# EAGLE design SteeringV2 (EAGLE 9.6.2)
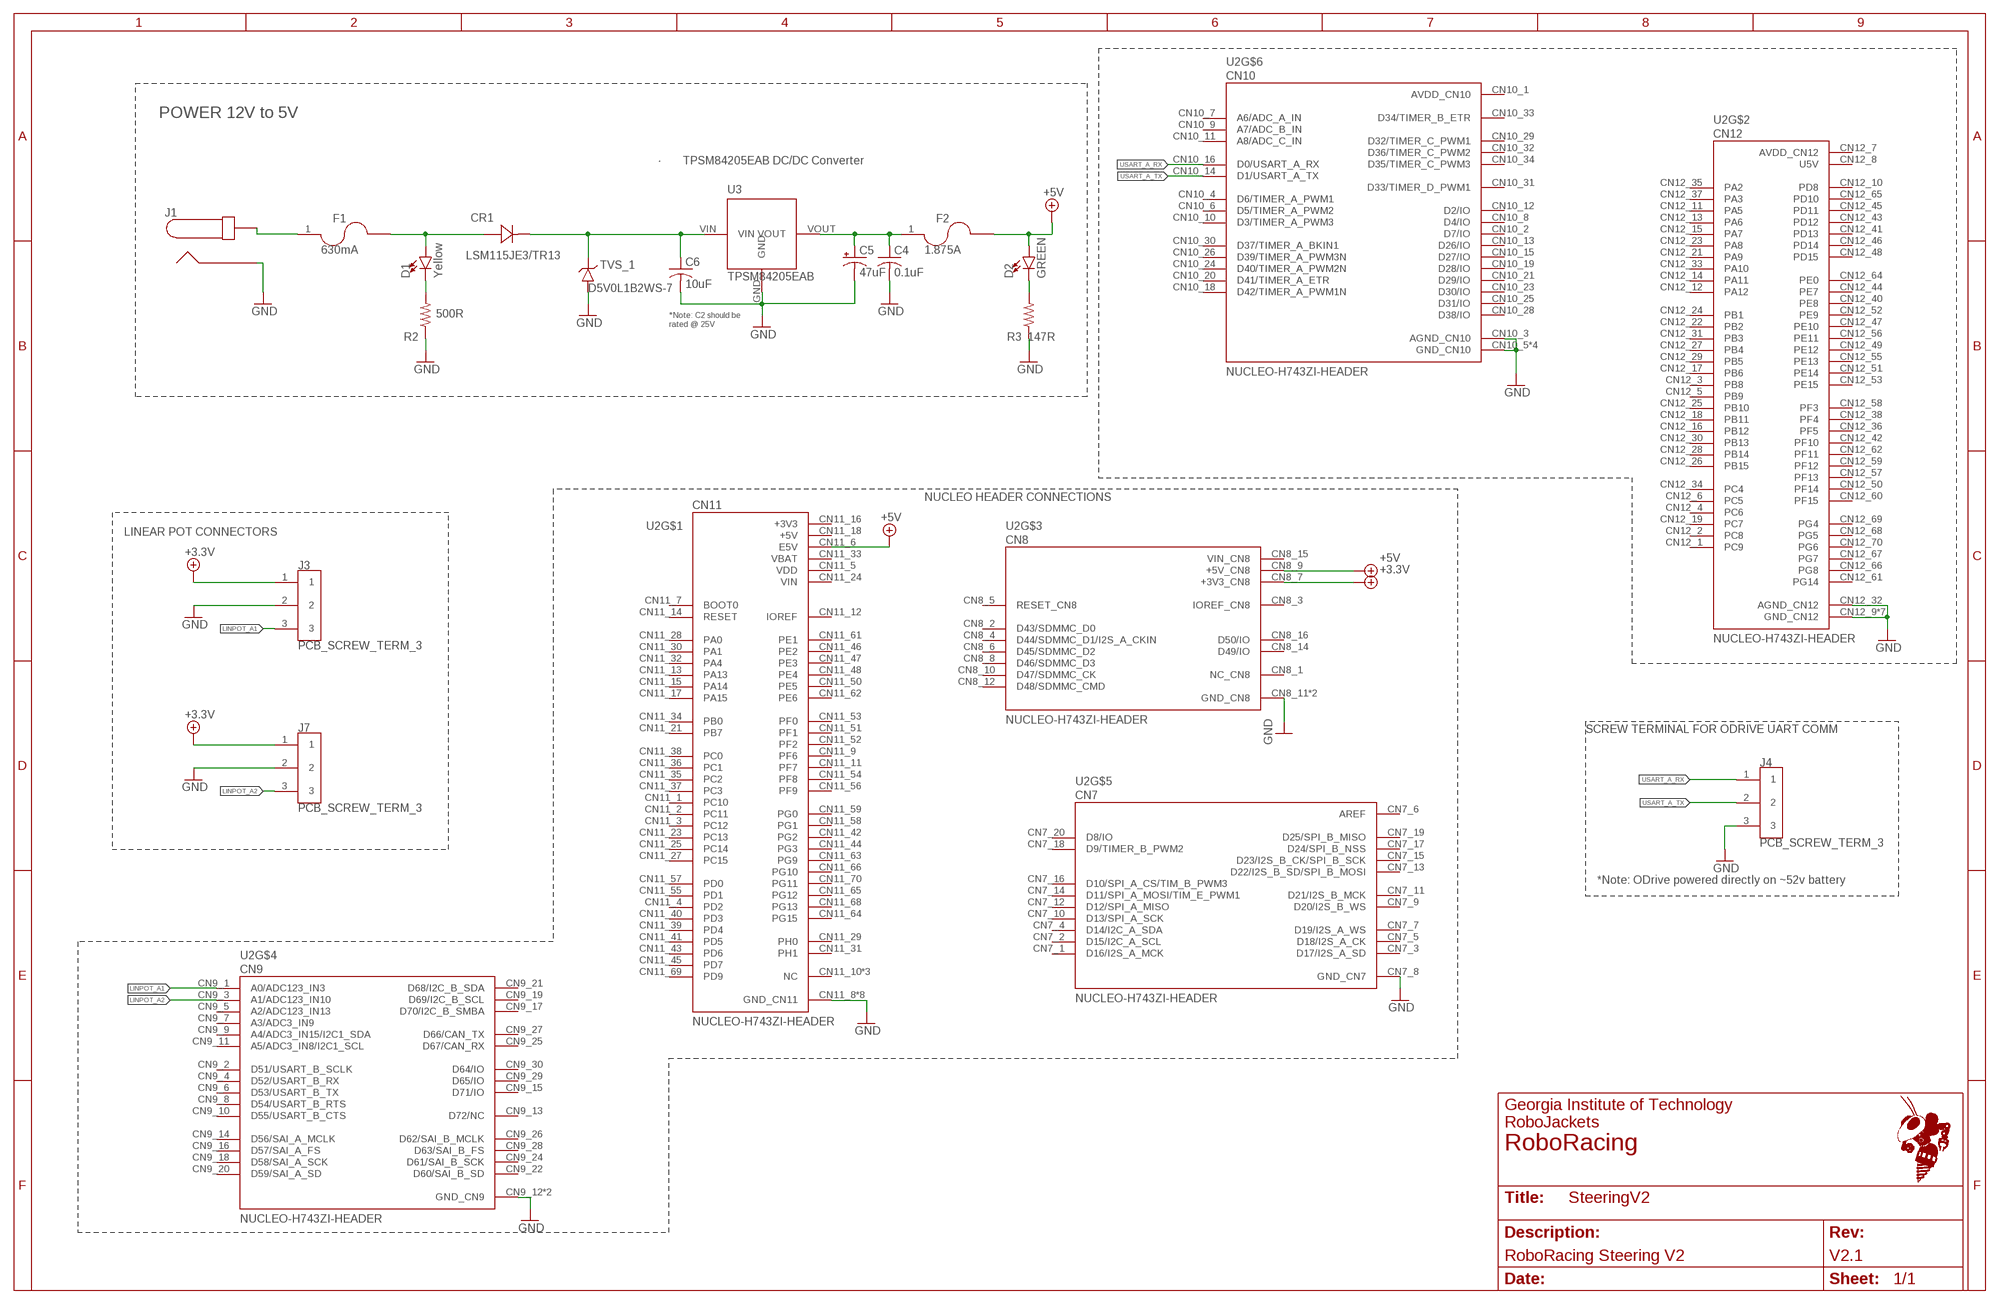
[diagram p0: schematic, sheet 1]
FRAME1 (FRAME_11_17): REVISION: V2.1; SCH_DESC: RoboRacing Steering V2; TEAM: RoboRacing

## Parts
C4  0.1uF  C-USC0805  [C0805]
C5  47uF  47UF-POLAR-EIA3528-10V-10%  [EIA3528]
C6  10uF  C-USC0805  [C0805]
CR1  LSM115JE3/TR13  [DO-214BA_MCH]
D1  Yellow  LED-YELLOW0603  [LED-0603]
D2  GREEN  LED-GREEN1206  [LED-1206]
F1  630mA  SMD_FUSE0603  [F0603]
F2  1.875A  SMD_FUSE0603  [F0603]
J1  PJ-037A  [PJ-037A]
J3  PCB_SCREW_TERM_3  [SCREW_TERMINAL_PCB_CONN_3_POLE]
J4  PCB_SCREW_TERM_3  [SCREW_TERMINAL_PCB_CONN_3_POLE]
J7  PCB_SCREW_TERM_3  [SCREW_TERMINAL_PCB_CONN_3_POLE]
R2  500R  R-US_R0603  [R0603]
R3  147R  R-US_R0603  [R0603]
TVS_1  D5V0L1B2WS-7  [SOD-323]
U2  NUCLEO-H743ZI-HEADER  [MODULE_NUCLEO-H743ZI]
U3  TPSM84205EAB  [TPSM84205EAB]

## Nets
5V_MAIN: C4.1 C5.A(+) F2.1 U3.VOUT
+3.3V: J3.1 J7.1 U2.CN8_7(+3V3_CN8)
+5V: D2.A F2.2 U2.CN8_9(+5V_CN8) U2.CN11_6(E5V)
GND: C4.2 C5.C(-) C6.2 J1.P$1 J3.2 J4.3 J7.2 R2.1 R3.1 TVS_1.A U2.CN7_8(GND_CN7) U2.CN8_11(GND_CN8) U2.CN8_13(GND_CN8) U2.CN9_12(GND_CN9) U2.CN9_23(GND_CN9) U2.CN10_3(AGND_CN10) U2.CN10_5(GND_CN10) U2.CN10_17(GND_CN10) U2.CN10_22(GND_CN10) U2.CN10_27(GND_CN10) U2.CN11_8(GND_CN11) U2.CN11_19(GND_CN11) U2.CN11_20(GND_CN11) U2.CN11_22(GND_CN11) U2.CN11_49(GND_CN11) U2.CN11_60(GND_CN11) U2.CN11_71(GND_CN11) U2.CN11_72(GND_CN11) U2.CN12_9(GND_CN12) U2.CN12_20(GND_CN12) U2.CN12_32(AGND_CN12) U2.CN12_39(GND_CN12) U2.CN12_54(GND_CN12) U2.CN12_63(GND_CN12) U2.CN12_71(GND_CN12) U2.CN12_72(GND_CN12) U3.GND
LINPOT_A1: J3.3 U2.CN9_1(A0/ADC123_IN3)
LINPOT_A2: J7.3 U2.CN9_3(A1/ADC123_IN10)
N$1: CR1.2 D1.A F1.2
N$3: C6.1 CR1.1 TVS_1.C U3.VIN
N$4: F1.1 J1.P$2
N$5: D1.C R2.2
N$6: D2.C R3.2
USART_A_RX: J4.1 U2.CN10_16(D0/USART_A_RX)
USART_A_TX: J4.2 U2.CN10_14(D1/USART_A_TX)
Unconnected: U2.CN7_1(D16/I2S_A_MCK) U2.CN7_2(D15/I2C_A_SCL) U2.CN7_3(D17/I2S_A_SD) U2.CN7_4(D14/I2C_A_SDA) U2.CN7_5(D18/I2S_A_CK) U2.CN7_7(D19/I2S_A_WS) U2.CN7_9(D20/I2S_B_WS) U2.CN7_10(D13/SPI_A_SCK) U2.CN7_11(D21/I2S_B_MCK) U2.CN7_12(D12/SPI_A_MISO) U2.CN7_13(D22/I2S_B_SD/SPI_B_MOSI) U2.CN7_14(D11/SPI_A_MOSI/TIM_E_PWM1) U2.CN7_15(D23/I2S_B_CK/SPI_B_SCK) U2.CN7_16(D10/SPI_A_CS/TIM_B_PWM3) U2.CN7_17(D24/SPI_B_NSS) U2.CN7_18(D9/TIMER_B_PWM2) U2.CN7_19(D25/SPI_B_MISO) U2.CN7_20(D8/IO) U2.CN8_1(NC_CN8) U2.CN8_2(D43/SDMMC_D0) U2.CN8_3(IOREF_CN8) U2.CN8_4(D44/SDMMC_D1/I2S_A_CKIN) U2.CN8_5(RESET_CN8) U2.CN8_6(D45/SDMMC_D2) U2.CN8_8(D46/SDMMC_D3) U2.CN8_10(D47/SDMMC_CK) U2.CN8_12(D48/SDMMC_CMD) U2.CN8_14(D49/IO) U2.CN8_16(D50/IO) U2.CN9_2(D51/USART_B_SCLK) U2.CN9_4(D52/USART_B_RX) U2.CN9_5(A2/ADC123_IN13) U2.CN9_6(D53/USART_B_TX) U2.CN9_7(A3/ADC3_IN9) U2.CN9_8(D54/USART_B_RTS) U2.CN9_9(A4/ADC3_IN15/I2C1_SDA) U2.CN9_10(D55/USART_B_CTS) U2.CN9_11(A5/ADC3_IN8/I2C1_SCL) U2.CN9_13(D72/NC) U2.CN9_14(D56/SAI_A_MCLK) U2.CN9_15(D71/IO) U2.CN9_16(D57/SAI_A_FS) U2.CN9_17(D70/I2C_B_SMBA) U2.CN9_18(D58/SAI_A_SCK) U2.CN9_19(D69/I2C_B_SCL) U2.CN9_20(D59/SAI_A_SD) U2.CN9_21(D68/I2C_B_SDA) U2.CN9_22(D60/SAI_B_SD) U2.CN9_24(D61/SAI_B_SCK) U2.CN9_25(D67/CAN_RX) U2.CN9_26(D62/SAI_B_MCLK) U2.CN9_27(D66/CAN_TX) U2.CN9_28(D63/SAI_B_FS) U2.CN9_29(D65/IO) U2.CN9_30(D64/IO) U2.CN10_2(D7/IO) U2.CN10_4(D6/TIMER_A_PWM1) U2.CN10_6(D5/TIMER_A_PWM2) U2.CN10_7(A6/ADC_A_IN) U2.CN10_8(D4/IO) U2.CN10_9(A7/ADC_B_IN) U2.CN10_10(D3/TIMER_A_PWM3) U2.CN10_11(A8/ADC_C_IN) U2.CN10_12(D2/IO) U2.CN10_13(D26/IO) U2.CN10_15(D27/IO) U2.CN10_18(D42/TIMER_A_PWM1N) U2.CN10_19(D28/IO) U2.CN10_20(D41/TIMER_A_ETR) U2.CN10_21(D29/IO) U2.CN10_23(D30/IO) U2.CN10_24(D40/TIMER_A_PWM2N) U2.CN10_25(D31/IO) U2.CN10_26(D39/TIMER_A_PWM3N) U2.CN10_28(D38/IO) U2.CN10_29(D32/TIMER_C_PWM1) U2.CN10_30(D37/TIMER_A_BKIN1) U2.CN10_31(D33/TIMER_D_PWM1) U2.CN10_32(D36/TIMER_C_PWM2) U2.CN10_33(D34/TIMER_B_ETR) U2.CN10_34(D35/TIMER_C_PWM3) U2.CN11_1(PC10) U2.CN11_2(PC11) U2.CN11_3(PC12) U2.CN11_4(PD2) U2.CN11_7(BOOT0) U2.CN11_9(PF6) U2.CN11_10(NC) U2.CN11_11(PF7) U2.CN11_12(IOREF) U2.CN11_13(PA13) U2.CN11_14(RESET) U2.CN11_15(PA14) U2.CN11_17(PA15) U2.CN11_21(PB7) U2.CN11_23(PC13) U2.CN11_25(PC14) U2.CN11_26(NC) U2.CN11_27(PC15) U2.CN11_28(PA0) U2.CN11_29(PH0) U2.CN11_30(PA1) U2.CN11_31(PH1) U2.CN11_32(PA4) U2.CN11_34(PB0) U2.CN11_35(PC2) U2.CN11_36(PC1) U2.CN11_37(PC3) U2.CN11_38(PC0) U2.CN11_39(PD4) U2.CN11_40(PD3) U2.CN11_41(PD5) U2.CN11_42(PG2) U2.CN11_43(PD6) U2.CN11_44(PG3) U2.CN11_45(PD7) U2.CN11_46(PE2) U2.CN11_47(PE3) U2.CN11_48(PE4) U2.CN11_50(PE5) U2.CN11_51(PF1) U2.CN11_52(PF2) U2.CN11_53(PF0) U2.CN11_54(PF8) U2.CN11_55(PD1) U2.CN11_56(PF9) U2.CN11_57(PD0) U2.CN11_58(PG1) U2.CN11_59(PG0) U2.CN11_61(PE1) U2.CN11_62(PE6) U2.CN11_63(PG9) U2.CN11_64(PG15) U2.CN11_65(PG12) U2.CN11_66(PG10) U2.CN11_67(NC) U2.CN11_68(PG13) U2.CN11_69(PD9) U2.CN11_70(PG11) U2.CN12_1(PC9) U2.CN12_2(PC8) U2.CN12_3(PB8) U2.CN12_4(PC6) U2.CN12_5(PB9) U2.CN12_6(PC5) U2.CN12_10(PD8) U2.CN12_11(PA5) U2.CN12_12(PA12) U2.CN12_13(PA6) U2.CN12_14(PA11) U2.CN12_15(PA7) U2.CN12_16(PB12) U2.CN12_17(PB6) U2.CN12_18(PB11) U2.CN12_19(PC7) U2.CN12_21(PA9) U2.CN12_22(PB2) U2.CN12_23(PA8) U2.CN12_24(PB1) U2.CN12_25(PB10) U2.CN12_26(PB15) U2.CN12_27(PB4) U2.CN12_28(PB14) U2.CN12_29(PB5) U2.CN12_30(PB13) U2.CN12_31(PB3) U2.CN12_33(PA10) U2.CN12_34(PC4) U2.CN12_35(PA2) U2.CN12_36(PF5) U2.CN12_37(PA3) U2.CN12_38(PF4) U2.CN12_40(PE8) U2.CN12_41(PD13) U2.CN12_42(PF10) U2.CN12_43(PD12) U2.CN12_44(PE7) U2.CN12_45(PD11) U2.CN12_46(PD14) U2.CN12_47(PE10) U2.CN12_48(PD15) U2.CN12_49(PE12) U2.CN12_50(PF14) U2.CN12_51(PE14) U2.CN12_52(PE9) U2.CN12_53(PE15) U2.CN12_55(PE13) U2.CN12_56(PE11) U2.CN12_57(PF13) U2.CN12_58(PF3) U2.CN12_59(PF12) U2.CN12_60(PF15) U2.CN12_61(PG14) U2.CN12_62(PF11) U2.CN12_64(PE0) U2.CN12_65(PD10) U2.CN12_66(PG8) U2.CN12_67(PG7) U2.CN12_68(PG5) U2.CN12_69(PG4) U2.CN12_70(PG6)

## Notes on the sheet
- POWER 12V to 5V
- ·       TPSM84205EAB DC/DC Converter
- *Note: C2 should be
  rated @ 25V
- NUCLEO HEADER CONNECTIONS
- LINEAR POT CONNECTORS
- SCREW TERMINAL FOR ODRIVE UART COMM
- *Note: ODrive powered directly on ~52v battery

## Power pins joined to a net without a drawn wire
+3V3: U2.CN11_16(+3V3)
+5V: U2.CN11_18(+5V)
AREF: U2.CN7_6(AREF)
AVDD_CN10: U2.CN10_1(AVDD_CN10)
AVDD_CN12: U2.CN12_7(AVDD_CN12)
U5V: U2.CN12_8(U5V)
VBAT: U2.CN11_33(VBAT)
VDD: U2.CN11_5(VDD)
VIN: U2.CN11_24(VIN)
VIN_CN8: U2.CN8_15(VIN_CN8)

## Library data of the parts
C4 C6 = rcl:C-US: CAPACITOR, American symbol; SPICEPREFIX: C
C5 = SparkFun-Capacitors:47UF-POLAR: 47µF polarized capacitors A capacitor is a passive two-terminal electrical component used to store electrical energy temporarily in an electric field.; PROD_ID: CAP-08310
CR1 = RoboRacing_STM:LSM115JE3/TR13; COPYRIGHT: Copyright (C) 2022 Ultra Librarian. All rights reserved.; MANUFACTURER_PART_NUMBER: LSM115JE3/TR13; MFR_NAME: Microchip
D1 = RoboJackets-LEDs:LED-YELLOW: Yellow SMD LED Used in manufacturing several products at SparkFun. Packages: 0603 - SMD 0603 package[Product Link] <http://www.kingbrightusa.com/product.asp?catalog_name=LED&product_id=APT1608SYCK> 0603 -SMART - SMART SMD 0603 package (more efficient/more expensive) [Product Link] <http://www.osram-os.com/osram_os/en/products/product-catalog/led-light-emitting-diodes/smartled-0603/ly-l29k/index.jsp> LilyPad - SMD1206 package[Product Datasheet] <https://www.sparkfun.com/datasheets/DevTools/LilyPad/Q150YUS4.pdf> SparkFun Products: Blynk Board <https://www.sparkfun.com/products/13794> IOIO-OTG <https://www.sparkfun.com/products/13613> XBee Explorer Serial <https://www.sparkfun.com/products/13225>; PROD_ID: DIO-09003
D2 = RoboJackets-LEDs:LED-GREEN: Green SMD LED Used in manufacturing of various products at SparkFun Packages: 0603 - SMD 0603 package [Product Link] <http://www.futureelectronics.com/en/technologies/semiconductors/optoelectronics/leds/Pages/9894312-LTST-C190GKT.aspx?CrossPart=HSMG-C190&IM=0> LilyPad 1206 - SMD1206 LilyPad package [Product Link] <http://www.futureelectronics.com/en/Technologies/Product.aspx?ProductID=IN150NGHARVATEKCORPORATION2049943&IM=0> 1206 - SMD1206 package [Product Link] <http://www.futureelectronics.com/en/technologies/semiconductors/optoelectronics/leds/Pages/8315665-LTST-C150KGKT.aspx?IM=0> 1206 Bottom Mount -SMD 1206 Bottom Mount [Product Link] <http://www.digikey.com/product-detail/en/lite-on-inc/LTST-C230KGKT/160-1456-1-ND/386854> SparkFun Products: Pro Mini 328 -5V <https://www.sparkfun.com/products/821> RedBoard <https://www.sparkfun.com/products/12757> MP3 Trigger <https://www.sparkfun.com/products/13720> Makey Makey <https://www.sparkfun.com/products/11076>; PROD_ID: DIO-00862
F1 F2 = RoboJackets-Fuses:SMD_FUSE: Generic part for SMD fuses
J1 = RoboJackets-Connectors:PJ-037A*: Description: Power Barrel Connector Jack 2.10mm ID (0.083"), 5.50mm OD (0.217") Through Hole, Right Angle Link 2.5A: Digi-Key <https://www.digikey.com/products/en?keywords=CP-037A-ND> Link 5A: Digi-Key <https://www.digikey.com/product-detail/en/cui-devices/PJ-037AH/CP-037AH-ND/1644547>; DKPN: CP-037A-ND
J3 J4 J7 = RoboJackets-Connectors:PCB_SCREW_TERM_3; DKPT: 732-2770-ND
R2 R3 = rcl:R-US_: RESISTOR, American symbol; SPICEPREFIX: R
TVS_1 = RoboJackets-Diodes:D5V0L1B2WS-7: TVS 5V Diode Datasheet <https://www.diodes.com/assets/Datasheets/D5V0L1B2WS.pdf>; DKPN: D5V0L1B2WS-7DICT-ND
U2 = RoboRacing_STM:NUCLEO-H743ZI-HEADER: STM32F429ZI, mbed-Enabled Development Nucleo-144 STM32F4 ARM® Cortex®-M4 MCU 32-Bit Embedded Evaluation Board; MANUFACTURER: STMicroelectronics; MAXIMUM_PACKAGE_HEIGHT: N/A; PARTREV: 8; STANDARD: Manufacturer Recommendations
U3 = RoboRacing_STM:TPSM84205EAB: 1.5A, 28V Input, 5V Output Power Module https://www.ti.com/lit/ds/symlink/tpsm84205.pdf?ts=1642464100890&ref_url=https%253A%252F%252Fwww.ti.com%252Fstore%252Fti%252Fen%252Fp%252Fproduct%252F%253Fp%253DTPSM84205EAB; DKPN: 296-47074-ND

## Board
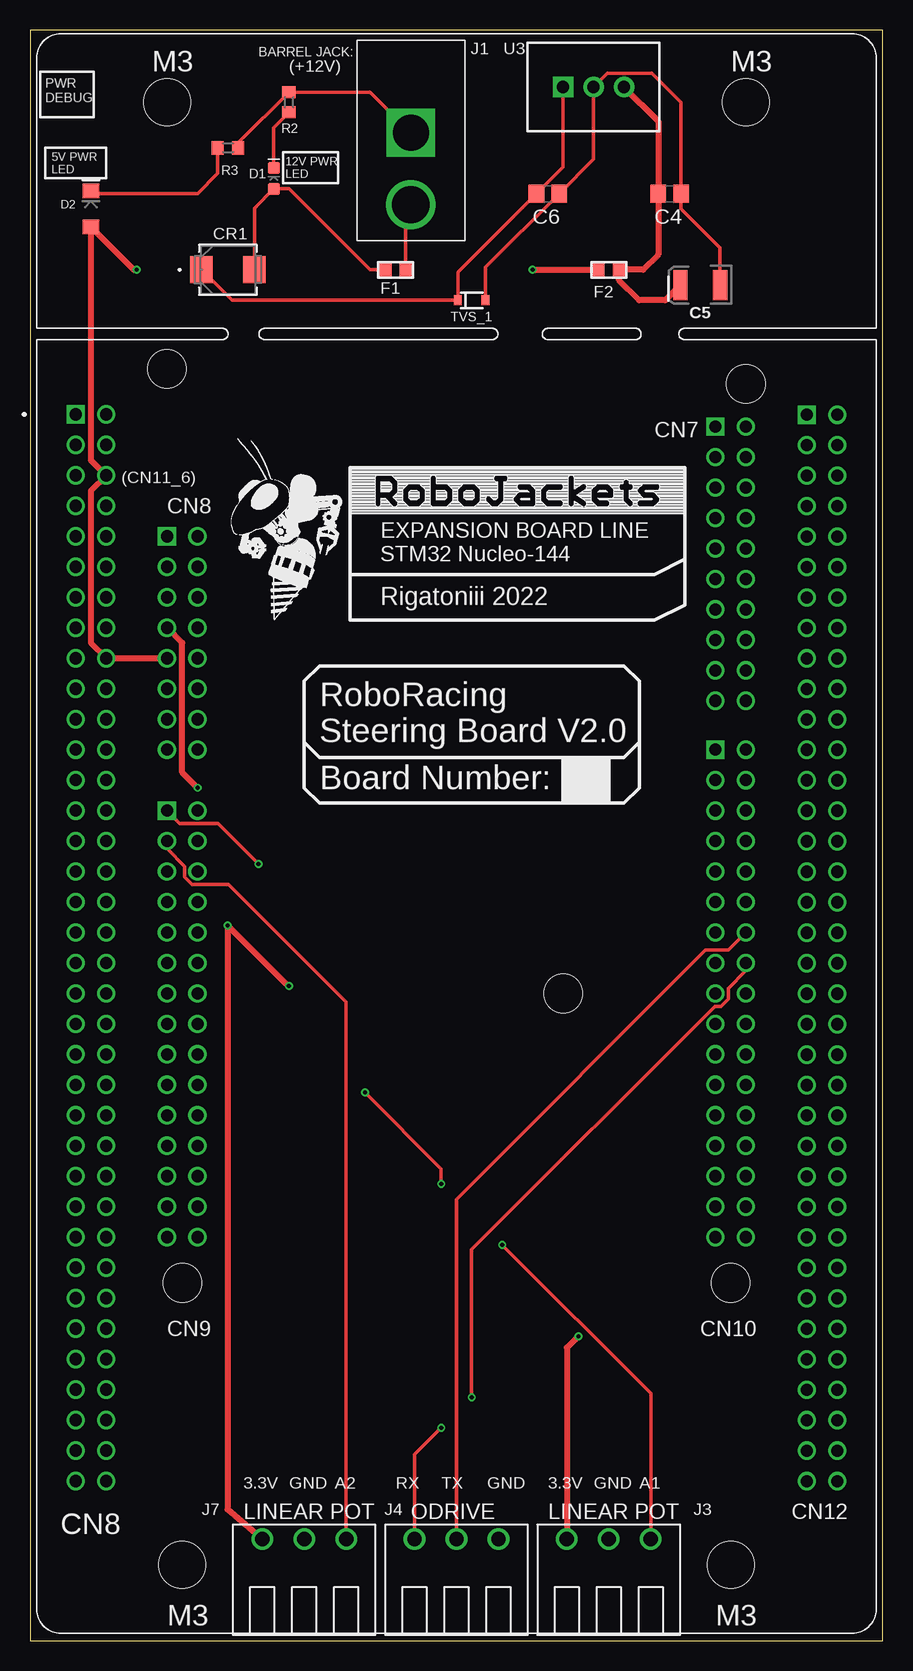
[diagram p1: board, top side]
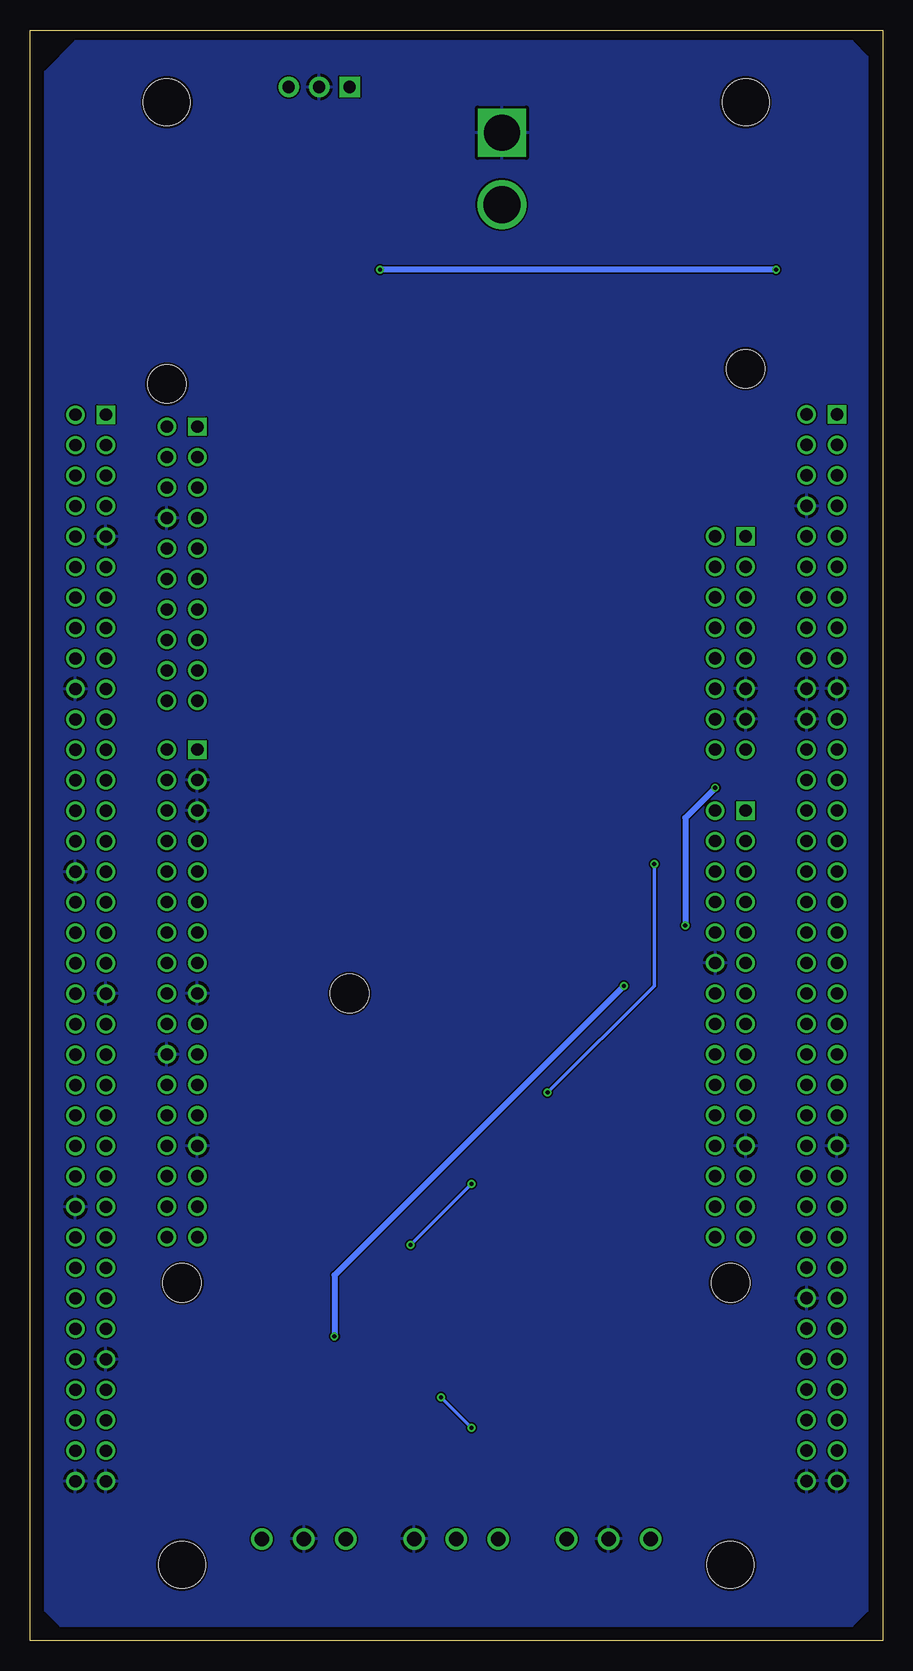
[diagram p2: board, bottom side, seen from below]

Size 71.1 x 134.29 mm. Coordinates in mm from the lower left corner, seen from the top.
Outline: 0,0 71.1,0 71.1,134.29 0,134.29 0,0
Copper layers (1+16): Top 0.035mm / dielectric 1.53mm / Bottom 0.035mm
Design rules "JLCPCB (2 Layer)": minimum track width 5mil, minimum drill 0.3mm, track to track 5mil, track to pad 5mil, pad to pad 5mil, via to via 20mil, smd to smd 5mil, copper to edge 0.2mm, drill to drill 21mil, minimum pad ring 6mil, minimum via ring 6mil, stop-mask expansion 2mil, vias tented up to drill 30mil, thermal gap 10mil

### Footprints (pad centres in the part's own frame; a part is rotated, then mirrored left to right if it is on the bottom)
C0805 = smd 1.3 x 1.5: 1 -0.95,0; 2 0.95,0
EIA3528 = smd 1.2 x 2.5: A 1.65,0; C -1.65,0
DO-214BA_MCH = smd 1.874 x 2.26: 1 -2.207,0; 2 2.207,0
LED-0603 = smd 1 x 1: A -0.877,0; C 0.877,0
LED-1206 = smd 1.2 x 1.4: A -1.5,0; C 1.5,0
F0603 = smd 1 x 1.1: 1 -0.85,0; 2 0.85,0
PJ-037A = drill 3 square: P$1 0,0 | drill 3.1: P$2 6,0
SCREW_TERMINAL_PCB_CONN_3_POLE = drill 1.2: 1 -3.5,3; 2 0,3; 3 3.5,3
R0603 = smd 1 x 1.1: 1 -0.85,0; 2 0.85,0
SOD-323 = smd 0.63 x 0.83: A 1.15,0; C -1.15,0
MODULE_NUCLEO-H743ZI = drill 1.02 square: CN7_1 21.59,33.914; CN8_1 -24.13,24.77; CN9_1 -24.13,1.91; CN10_1 21.59,6.99; CN11_1 -31.75,34.93; CN12_1 29.21,34.91 | drill 1.02: CN7_2 24.13,33.914; CN7_3 21.59,31.374; CN7_4 24.13,31.374; CN7_5 21.59,28.834; CN7_6 24.13,28.834; CN7_7 21.59,26.294; CN7_8 24.13,26.294; CN7_9 21.59,23.754; CN7_10 24.13,23.754; CN7_11 21.59,21.214; CN7_12 24.13,21.214; CN7_13 21.59,18.674; CN7_14 24.13,18.674; CN7_15 21.59,16.134; CN7_16 24.13,16.134; CN7_17 21.59,13.594; CN7_18 24.13,13.594; CN7_19 21.59,11.054; CN7_20 24.13,11.054; CN8_2 -21.59,24.77; CN8_3 -24.13,22.23; CN8_4 -21.59,22.23; CN8_5 -24.13,19.69; CN8_6 -21.59,19.69; CN8_7 -24.13,17.15; CN8_8 -21.59,17.15; CN8_9 -24.13,14.61; CN8_10 -21.59,14.61; CN8_11 -24.13,12.07; CN8_12 -21.59,12.07; CN8_13 -24.13,9.53; CN8_14 -21.59,9.53; CN8_15 -24.13,6.99; CN8_16 -21.59,6.99; CN9_2 -21.59,1.91; CN9_3 -24.13,-0.63; CN9_4 -21.59,-0.63; CN9_5 -24.13,-3.17; CN9_6 -21.59,-3.17; CN9_7 -24.13,-5.71; CN9_8 -21.59,-5.71; CN9_9 -24.13,-8.25; CN9_10 -21.59,-8.25; CN9_11 -24.13,-10.79; CN9_12 -21.59,-10.79; CN9_13 -24.13,-13.33; CN9_14 -21.59,-13.33; CN9_15 -24.13,-15.87; CN9_16 -21.59,-15.87; CN9_17 -24.13,-18.41; CN9_18 -21.59,-18.41; CN9_19 -24.13,-20.95; CN9_20 -21.59,-20.95; CN9_21 -24.13,-23.49; CN9_22 -21.59,-23.49; CN9_23 -24.13,-26.03; CN9_24 -21.59,-26.03; CN9_25 -24.13,-28.57; CN9_26 -21.59,-28.57; CN9_27 -24.13,-31.11; CN9_28 -21.59,-31.11; CN9_29 -24.13,-33.65; CN9_30 -21.59,-33.65; CN10_2 24.13,6.99; CN10_3 21.59,4.45; CN10_4 24.13,4.45; CN10_5 21.59,1.91; CN10_6 24.13,1.91; CN10_7 21.59,-0.63; CN10_8 24.13,-0.63; CN10_9 21.59,-3.17; CN10_10 24.13,-3.17; CN10_11 21.59,-5.71; CN10_12 24.13,-5.71; CN10_13 21.59,-8.25; CN10_14 24.13,-8.25; CN10_15 21.59,-10.79; CN10_16 24.13,-10.79; CN10_17 21.59,-13.33; CN10_18 24.13,-13.33; CN10_19 21.59,-15.87; CN10_20 24.13,-15.87; CN10_21 21.59,-18.41; CN10_22 24.13,-18.41; CN10_23 21.59,-20.95; CN10_24 24.13,-20.95; CN10_25 21.59,-23.49; CN10_26 24.13,-23.49; CN10_27 21.59,-26.03; CN10_28 24.13,-26.03; CN10_29 21.59,-28.57; CN10_30 24.13,-28.57; CN10_31 21.59,-31.11; CN10_32 24.13,-31.11; CN10_33 21.59,-33.65; CN10_34 24.13,-33.65; CN11_2 -29.21,34.93; CN11_3 -31.75,32.39; CN11_4 -29.21,32.39; CN11_5 -31.75,29.85; CN11_6 -29.21,29.85; CN11_7 -31.75,27.31; CN11_8 -29.21,27.31; CN11_9 -31.75,24.77; CN11_10 -29.21,24.77; CN11_11 -31.75,22.23; CN11_12 -29.21,22.23; CN11_13 -31.75,19.69; CN11_14 -29.21,19.69; CN11_15 -31.75,17.15; CN11_16 -29.21,17.15; CN11_17 -31.75,14.61; CN11_18 -29.21,14.61; CN11_19 -31.75,12.07; CN11_20 -29.21,12.07; CN11_21 -31.75,9.53; CN11_22 -29.21,9.53; CN11_23 -31.75,6.99; CN11_24 -29.21,6.99; CN11_25 -31.75,4.45; CN11_26 -29.21,4.45; CN11_27 -31.75,1.91; CN11_28 -29.21,1.91; CN11_29 -31.75,-0.63; CN11_30 -29.21,-0.63; CN11_31 -31.75,-3.17; CN11_32 -29.21,-3.17; CN11_33 -31.75,-5.71; CN11_34 -29.21,-5.71; CN11_35 -31.75,-8.25; CN11_36 -29.21,-8.25; CN11_37 -31.75,-10.79; CN11_38 -29.21,-10.79; CN11_39 -31.75,-13.33; CN11_40 -29.21,-13.33; CN11_41 -31.75,-15.87; CN11_42 -29.21,-15.87; CN11_43 -31.75,-18.41; CN11_44 -29.21,-18.41; CN11_45 -31.75,-20.95; CN11_46 -29.21,-20.95; CN11_47 -31.75,-23.49; CN11_48 -29.21,-23.49; CN11_49 -31.75,-26.03; CN11_50 -29.21,-26.03; CN11_51 -31.75,-28.57; CN11_52 -29.21,-28.57; CN11_53 -31.75,-31.11; CN11_54 -29.21,-31.11; CN11_55 -31.75,-33.65; CN11_56 -29.21,-33.65; CN11_57 -31.75,-36.19; CN11_58 -29.21,-36.19; CN11_59 -31.75,-38.73; CN11_60 -29.21,-38.73; CN11_61 -31.75,-41.27; CN11_62 -29.21,-41.27; CN11_63 -31.75,-43.81; CN11_64 -29.21,-43.81; CN11_65 -31.75,-46.35; CN11_66 -29.21,-46.35; CN11_67 -31.75,-48.89; CN11_68 -29.21,-48.89; CN11_69 -31.75,-51.43; CN11_70 -29.21,-51.43; CN11_71 -31.75,-53.97; CN11_72 -29.21,-53.97; CN12_2 31.75,34.91; CN12_3 29.21,32.37; CN12_4 31.75,32.37; CN12_5 29.21,29.83; CN12_6 31.75,29.83; CN12_7 29.21,27.29; CN12_8 31.75,27.29; CN12_9 29.21,24.75; CN12_10 31.75,24.75; CN12_11 29.21,22.21; CN12_12 31.75,22.21; CN12_13 29.21,19.67; CN12_14 31.75,19.67; CN12_15 29.21,17.13; CN12_16 31.75,17.13; CN12_17 29.21,14.59; CN12_18 31.75,14.59; CN12_19 29.21,12.05; CN12_20 31.75,12.05; CN12_21 29.21,9.51; CN12_22 31.75,9.51; CN12_23 29.21,6.97; CN12_24 31.75,6.97; CN12_25 29.21,4.43; CN12_26 31.75,4.43; CN12_27 29.21,1.89; CN12_28 31.75,1.89; CN12_29 29.21,-0.65; CN12_30 31.75,-0.65; CN12_31 29.21,-3.19; CN12_32 31.75,-3.19; CN12_33 29.21,-5.73; CN12_34 31.75,-5.73; CN12_35 29.21,-8.27; CN12_36 31.75,-8.27; CN12_37 29.21,-10.81; CN12_38 31.75,-10.81; CN12_39 29.21,-13.35; CN12_40 31.75,-13.35; CN12_41 29.21,-15.89; CN12_42 31.75,-15.89; CN12_43 29.21,-18.43; CN12_44 31.75,-18.43; CN12_45 29.21,-20.97; CN12_46 31.75,-20.97; CN12_47 29.21,-23.51; CN12_48 31.75,-23.51; CN12_49 29.21,-26.05; CN12_50 31.75,-26.05; CN12_51 29.21,-28.59; CN12_52 31.75,-28.59; CN12_53 29.21,-31.13; CN12_54 31.75,-31.13; CN12_55 29.21,-33.67; CN12_56 31.75,-33.67; CN12_57 29.21,-36.21; CN12_58 31.75,-36.21; CN12_59 29.21,-38.75; CN12_60 31.75,-38.75; CN12_61 29.21,-41.29; CN12_62 31.75,-41.29; CN12_63 29.21,-43.83; CN12_64 31.75,-43.83; CN12_65 29.21,-46.37; CN12_66 31.75,-46.37; CN12_67 29.21,-48.91; CN12_68 31.75,-48.91; CN12_69 29.21,-51.45; CN12_70 31.75,-51.45; CN12_71 29.21,-53.99; CN12_72 31.75,-53.99 | hole 3.2: -22.86,-37.46; 22.86,-37.46; 24.13,37.47; 8.89,-13.33; -24.13,38.74
TPSM84205EAB = drill 1.01 pad 1.71: GND 0,0; VOUT 2.54,0 | drill 1.01 pad 1.71 square: VIN -2.54,0
STANDOFF-HOLE = hole 3.9: 0,0

### Placement (x,y rotation side)
C4  53.34,120.65 0 top
C5  55.88,113.03 180 top
C6  43.18,120.65 0 top
CR1  16.51,114.3 0 top
D1  20.32,121.92 90 top
D2  5.08,119.38 90 top
F1  30.48,114.3 180 top
F2  48.26,114.3 180 top
J1  31.75,125.73 270 top
J3  48.26,5.5 0 top
J4  35.56,5.5 0 top
J7  22.86,5.5 0 top
R2  21.59,128.27 270 top
R3  16.51,124.46 180 top
TVS_1  36.83,111.76 0 top
U2  35.56,67.31 0 top
U3  46.99,129.54 0 top
U$1  [ROBOBUZZ_0.8X]  20.32,85.09 0 top
U$2  [STANDOFF-HOLE]  11.43,128.27 0 top
U$3  [STANDOFF-HOLE]  59.69,128.27 0 top
U$4  [STANDOFF-HOLE]  12.7,6.35 0 top
U$5  [STANDOFF-HOLE]  58.42,6.35 0 top
U$6  [ROBOJACKETS]  26.67,93.98 0 top

### Tracks (layer width: path | path; a pad name or v marks a point on that pad's centre or on a via)
5V_MAIN
  Top 0.5: U3.VOUT 52.39,126.68 C4.1 52.39,115.57 51.12,114.3 F2.1 49.11,113.45 50.8,111.76 52.96,111.76 C5.A
+3.3V  (via drill 0.35)
  Top 0.5: v13.97,71.12 12.7,72.39 12.7,83.19 U2.CN8_7 | J7.1 16.47,10.97 v16.47,59.65 21.51,54.61 v21.59,54.61 | v45.72,25.4 44.76,24.44 J3.1
  Bottom 0.5: v13.97,71.12 16.47,68.62 v16.47,59.65 | v21.59,54.61 45.72,30.48 v45.72,25.4
+5V  (via drill 0.35)
  Top 0.5: v8.89,114.3 8.66,114.3 D2.A 5.08,98.43 U2.CN11_6 5.08,95.89 5.08,83.19 U2.CN11_18 U2.CN8_9 | v41.91,114.3 F2.2
  Bottom 0.5: v8.89,114.3 v41.91,114.3
GND
  Top 0.3: J1.P$1 28.36,129.12 R2.1 17.36,124.89 R3.1 | TVS_1.A 37.98,114.5 C6.2 46.99,123.51 U3.GND 48.15,130.7 51.86,130.7 54.29,128.27 C4.2 54.29,119.38 57.53,116.14 C5.C
  pour Bottom: 1.27,132.08 1.27,2.54 2.54,1.27 68.58,1.27 69.85,2.54 69.85,130.81 67.31,133.35 2.54,133.35
LINPOT_A1  (via drill 0.35)
  Top 0.3: J3.3 51.76,20.63 v39.37,33.02 | v34.29,38.1 34.29,39.37 v27.94,45.72 | v19.05,64.77 15.67,68.15 12.5,68.15 U2.CN9_1
  Bottom 0.3: v39.37,33.02 v34.29,38.1 | v27.94,45.72 19.05,54.61 v19.05,64.77
LINPOT_A2
  Top 0.3: J7.3 26.36,53.26 16.55,63.07 13.53,63.07 12.9,63.7 12.9,64.57 11.43,66.04 U2.CN9_3
N$1
  Top 0.3: CR1.2 18.72,119.44 D1.A 21.62,121.04 28.36,114.3 F1.2
N$3
  Top 0.3: CR1.1 16.84,111.76 TVS_1.C 35.68,114.1 C6.1 44.45,122.87 U3.VIN
N$4
  Top 0.3: F1.1 31.33,119.31 J1.P$2
N$5
  Top 0.3: R2.2 20.32,126.15 D1.C
N$6
  Top 0.3: R3.2 15.66,122.34 13.97,120.65 5.31,120.65 D2.C
USART_A_RX  (via drill 0.35)
  Top 0.3: v36.83,20.32 36.83,32.63 57.11,52.91 57.59,52.91 58.22,53.54 58.22,54.41 59.69,55.88 U2.CN10_16 | v34.29,17.78 32.06,15.55 J4.1
  Bottom 0.3: v36.83,20.32 v34.29,17.78
USART_A_TX
  Top 0.3: U2.CN10_14 58.22,57.59 56.32,57.59 35.56,36.83 J4.2

### Text on the board
tPlace: BARREL JACK: | M3 | (+12V) | M3 | PWR / DEBUG | 5V PWR / LED | D1 | 12V PWR / LED | D2 | CR1 | CN7 | (CN11_6) | CN8 | EXPANSION BOARD LINE / STM32 Nucleo-144 | Rigatoniii 2022 | RoboRacing / Steering Board V2.0 | Board Number: | CN9 | CN10 | 3.3V | GND | A2 | RX | TX | GND | 3.3V | GND | A1 | LINEAR POT | ODRIVE | LINEAR POT | CN12 | CN8 | M3 | M3